# EAGLE design TMC5160_SPI_rev2 (EAGLE 9.2.2)
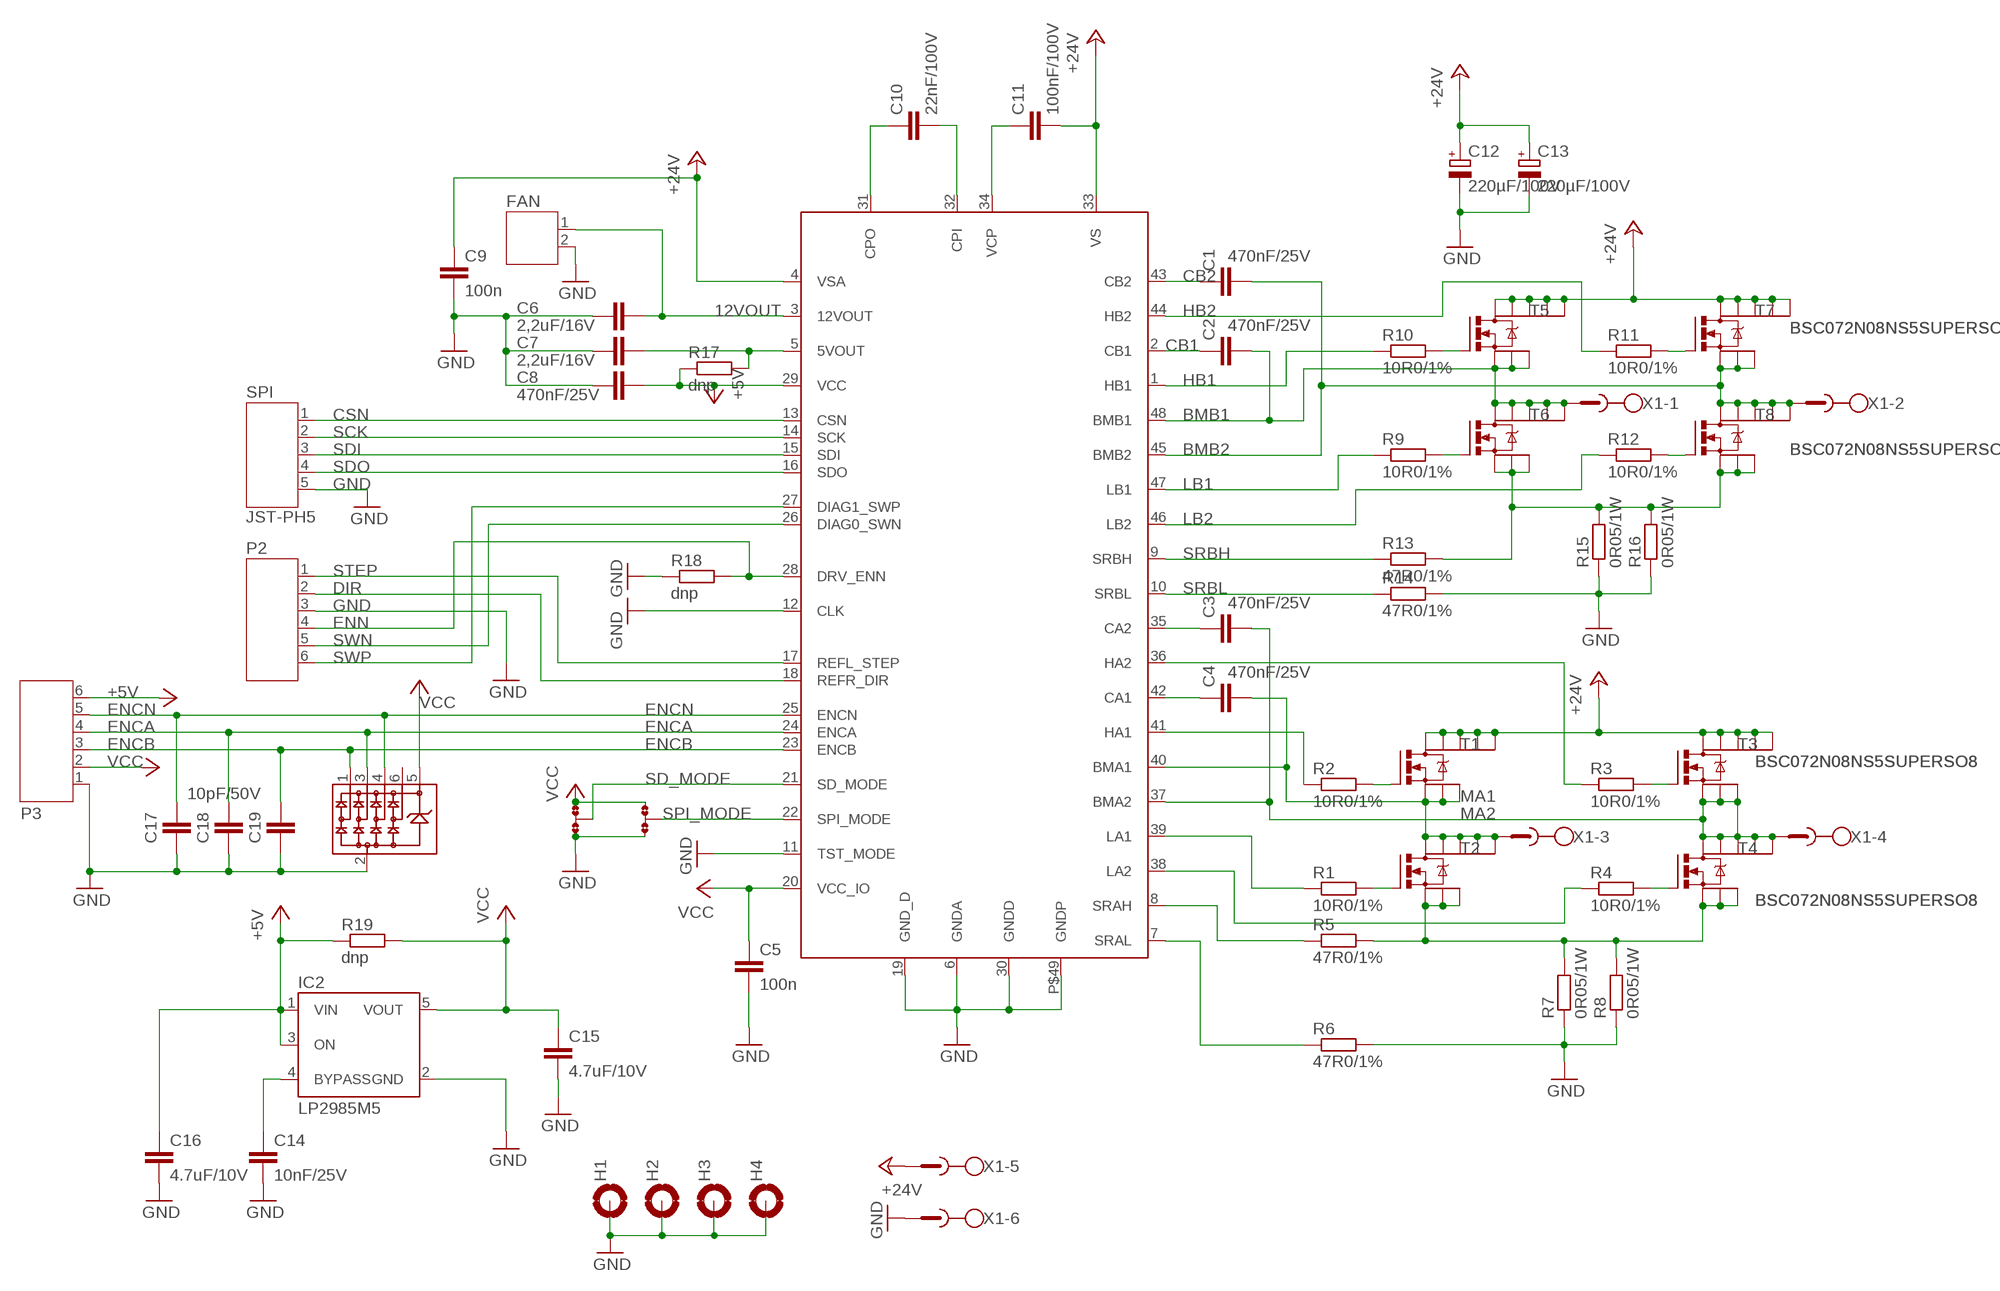
[diagram p0: schematic, sheet 1]

## Parts
C1  470nF/25V  C-EUC0805  [C0805]
C2  470nF/25V  C-EUC0805  [C0805]
C3  470nF/25V  C-EUC0805  [C0805]
C4  470nF/25V  C-EUC0805  [C0805]
C5  100n  C-EUC0603  [C0603]
C6  2,2uF/16V  C-EUC0805  [C0805]
C7  2,2uF/16V  C-EUC0805  [C0805]
C8  470nF/25V  C-EUC0805  [C0805]
C9  100n  C-EUC0603  [C0603]
C10  22nF/100V  C-EUC0805  [C0805]
C11  100nF/100V  C-EUC0805  [C0805]
C12  220µF/100V  CPOL-EU153CLV-1014  [153CLV-1014]
C13  220µF/100V  CPOL-EU153CLV-1014  [153CLV-1014]
C14  10nF/25V  C-EUC0603  [C0603]
C15  4.7uF/10V  C-EUC0603  [C0603]
C16  4.7uF/10V  C-EUC0603  [C0603]
C17  10pF/50V  C-EUC0603  [C0603]
C18  10pF/50V  C-EUC0603  [C0603]
C19  10pF/50V  C-EUC0603  [C0603]
D1  SRV05-4SOT23-6-3D  [SOT23-6]
FAN  JST-PH2  [JST-PH2]
H1  MOUNT-PAD-ROUND3.2  [3,2-PAD]
H2  MOUNT-PAD-ROUND3.2  [3,2-PAD]
H3  MOUNT-PAD-ROUND3.2  [3,2-PAD]
H4  MOUNT-PAD-ROUND3.2  [3,2-PAD]
IC2  LP2985M5  [SOT23-5]
JMP1  0R-JUMPA  [A0R-JMP]
JMP2  0R-JUMPA  [A0R-JMP]
P2  JST-PH6  [JST-PH6]
P3  JST-PH6  [JST-PH6]
R1  10R0/1%  R-EU_R0603  [R0603]
R2  10R0/1%  R-EU_R0603  [R0603]
R3  10R0/1%  R-EU_R0603  [R0603]
R4  10R0/1%  R-EU_R0603  [R0603]
R5  47R0/1%  R-EU_R0603  [R0603]
R6  47R0/1%  R-EU_R0603  [R0603]
R7  0R05/1W  R-EU_R3225  [R3225]
R8  0R05/1W  R-EU_R3225  [R3225]
R9  10R0/1%  R-EU_R0603  [R0603]
R10  10R0/1%  R-EU_R0603  [R0603]
R11  10R0/1%  R-EU_R0603  [R0603]
R12  10R0/1%  R-EU_R0603  [R0603]
R13  47R0/1%  R-EU_R0603  [R0603]
R14  47R0/1%  R-EU_R0603  [R0603]
R15  0R05/1W  R-EU_R3225  [R3225]
R16  0R05/1W  R-EU_R3225  [R3225]
R17  dnp  R-EU_R0603  [R0603]
R18  dnp  R-EU_R0603  [R0603]
R19  dnp  R-EU_R0603  [R0603]
SPI  JST-PH5  [JST-PH5]
T1  BSC072N08NS5SUPERSO8  [SOTFL127P615X110-8]
T2  BSC072N08NS5SUPERSO8  [SOTFL127P615X110-8]
T3  BSC072N08NS5SUPERSO8  [SOTFL127P615X110-8]
T4  BSC072N08NS5SUPERSO8  [SOTFL127P615X110-8]
T5  BSC072N08NS5SUPERSO8  [SOTFL127P615X110-8]
T6  BSC072N08NS5SUPERSO8  [SOTFL127P615X110-8]
T7  BSC072N08NS5SUPERSO8  [SOTFL127P615X110-8]
T8  BSC072N08NS5SUPERSO8  [SOTFL127P615X110-8]
TMC5160  TMC5160-TA  [QFP50P900X900X120-48]
X1  AKL166-06  [AKL166-06]

## Nets
12VOUT: C6.2 FAN.1 TMC5160.3(12VOUT)
+5V: C8.2 C16.1 IC2.1(VIN) IC2.3(ON) P3.6 R17.1 R19.1 TMC5160.29(VCC)
+24V: C9.1 C11.2 C12.+ C13.+ T1.D T1.D5(D1) T1.D6(D2) T1.D7(D3) T1.D8(D4) T3.D T3.D5(D1) T3.D6(D2) T3.D7(D3) T3.D8(D4) T5.D T5.D5(D1) T5.D6(D2) T5.D7(D3) T5.D8(D4) T7.D T7.D5(D1) T7.D6(D2) T7.D7(D3) T7.D8(D4) TMC5160.4(VSA) TMC5160.33(VS) X1.5
BMB1: C2.2 T5.S1 T5.S2 T5.S3(S) T6.D T6.D5(D1) T6.D6(D2) T6.D7(D3) T6.D8(D4) TMC5160.48(BMB1) X1.1
BMB2: C1.2 T7.S1 T7.S2 T7.S3(S) T8.D T8.D5(D1) T8.D6(D2) T8.D7(D3) T8.D8(D4) TMC5160.45(BMB2) X1.2
CB1: C2.1 TMC5160.2(CB1)
CB2: C1.1 TMC5160.43(CB2)
CSN: SPI.1 TMC5160.13(CSN)
DIR: P2.2 TMC5160.18(REFR_DIR)
ENCA: C18.1 D1.3 P3.4 TMC5160.24(ENCA)
ENCB: C19.1 D1.1 P3.3 TMC5160.23(ENCB)
ENCN: C17.1 D1.4 P3.5 TMC5160.25(ENCN)
ENN: P2.4 R18.2 TMC5160.28(DRV_ENN)
GND: C5.2 C6.1 C7.2 C8.1 C9.2 C12.- C13.- C14.2 C15.2 C16.2 C17.2 C18.2 C19.2 D1.2 FAN.2 H1.B3,2(MOUNT) H2.B3,2(MOUNT) H3.B3,2(MOUNT) H4.B3,2(MOUNT) IC2.2(GND) JMP1.3 JMP2.3 P2.3 P3.1 R6.2 R7.1 R8.1 R14.2 R15.1 R16.1 R18.1 SPI.5 TMC5160.6(GNDA) TMC5160.11(TST_MODE) TMC5160.12(CLK) TMC5160.19(GND_D) TMC5160.30(GNDD) TMC5160.P$49(GNDP) X1.6
HB1: R10.1 TMC5160.1(HB1)
HB2: R11.1 TMC5160.44(HB2)
LB1: R9.1 TMC5160.47(LB1)
LB2: R12.1 TMC5160.46(LB2)
MA1: C4.2 T1.S1 T1.S2 T1.S3(S) T2.D T2.D5(D1) T2.D6(D2) T2.D7(D3) T2.D8(D4) TMC5160.40(BMA1) X1.3
MA2: C3.2 T3.S1 T3.S2 T3.S3(S) T4.D T4.D5(D1) T4.D6(D2) T4.D7(D3) T4.D8(D4) TMC5160.37(BMA2) X1.4
N$1: R1.2 T2.G
N$2: R2.2 T1.G
N$3: R3.2 T3.G
N$4: R4.2 T4.G
N$7: R5.2 R7.2 R8.2 T2.S1 T2.S2 T2.S3(S) T4.S1 T4.S2 T4.S3(S)
N$11: R9.2 T6.G
N$12: R10.2 T5.G
N$13: R11.2 T7.G
N$14: R12.2 T8.G
N$15: R13.2 R15.2 R16.2 T6.S1 T6.S2 T6.S3(S) T8.S1 T8.S2 T8.S3(S)
N$26: C4.1 TMC5160.42(CA1)
N$27: C3.1 TMC5160.35(CA2)
N$28: R3.1 TMC5160.36(HA2)
N$29: R4.1 TMC5160.38(LA2)
N$30: R1.1 TMC5160.39(LA1)
N$31: R2.1 TMC5160.41(HA1)
N$32: C14.1 IC2.4(BYPASS)
N$34: R5.1 TMC5160.8(SRAH)
N$35: R6.1 TMC5160.7(SRAL)
N$41: C7.1 R17.2 TMC5160.5(5VOUT)
N$47: C10.1 TMC5160.31(CPO)
N$48: C10.2 TMC5160.32(CPI)
N$49: C11.1 TMC5160.34(VCP)
SCK: SPI.2 TMC5160.14(SCK)
SD_MODE: JMP1.2 TMC5160.21(SD_MODE)
SDI: SPI.3 TMC5160.15(SDI)
SDO: SPI.4 TMC5160.16(SDO)
SPI_MODE: JMP2.2 TMC5160.22(SPI_MODE)
SRBH: R13.1 TMC5160.9(SRBH)
SRBL: R14.1 TMC5160.10(SRBL)
STEP: P2.1 TMC5160.17(REFL_STEP)
SWN: P2.5 TMC5160.26(DIAG0_SWN)
SWP: P2.6 TMC5160.27(DIAG1_SWP)
VCC: C5.1 C15.1 D1.5 IC2.5(VOUT) JMP1.1 JMP2.1 P3.2 R19.2 TMC5160.20(VCC_IO)
Unconnected: D1.6

## Library data of the parts
C1-C11 C14-C19 = rcl:C-EU: CAPACITOR, European symbol; SPICEPREFIX: C
C12 C13 = rcl:CPOL-EU: POLARIZED CAPACITOR, European symbol; SPICEPREFIX: C
D1 = myDBv7:SRV05-4: SRV05-4.TCT TVS DIODE 5V 17.5V SOT23-6 RailClamp®, SR Semtech Corporation Unidirektionale Kanäle 4
FAN = jst-ph:JST-PH2
H1-H4 = holes:MOUNT-PAD-ROUND: MOUNTING PAD, round
IC2 = v-reg-3:LP2985: National Semiconductor <http://www.national.com> Micropower Linear Regulator 150mA regulated output, Vin 16V max., ultra-low dropout of 300mV @ 150mA, 1µA standby current, low noise
JMP1 JMP2 = jump-0r-smd:0R-JUMP: SMD 0R 0805 Jumper
P2 P3 = jst-ph:JST-PH6
R1-R19 = rcl:R-EU_: RESISTOR, European symbol; SPICEPREFIX: R
SPI = jst-ph:JST-PH5
T1-T8 = myDBv7:BSC072N08NS5
TMC5160 = myDBv7:TMC5160-TA
X1 = con-riacon:AKL166-06: RM 3,5mm AKL 166-06 :: Steckbare Anschlussklemme 2-polig, RM3,5mm + STL 224-02 :: Stiftleiste für Anschlussklemme 2-polig, RM3,5mm

## Board
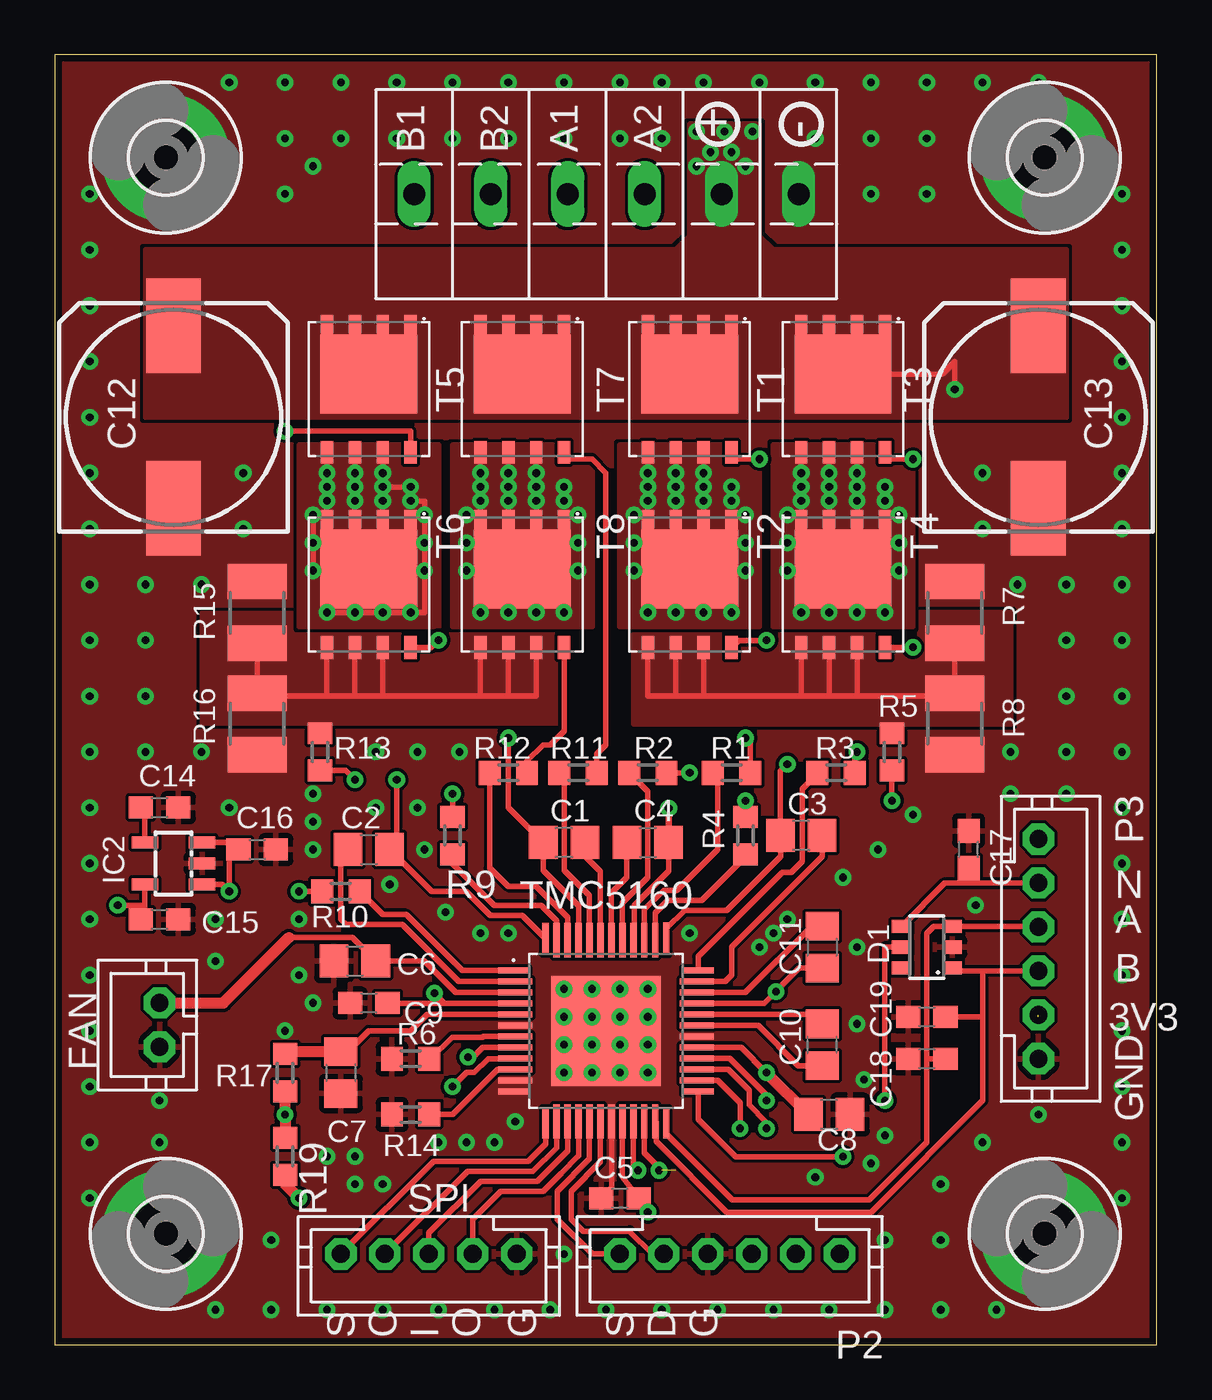
[diagram p1: board, top side]
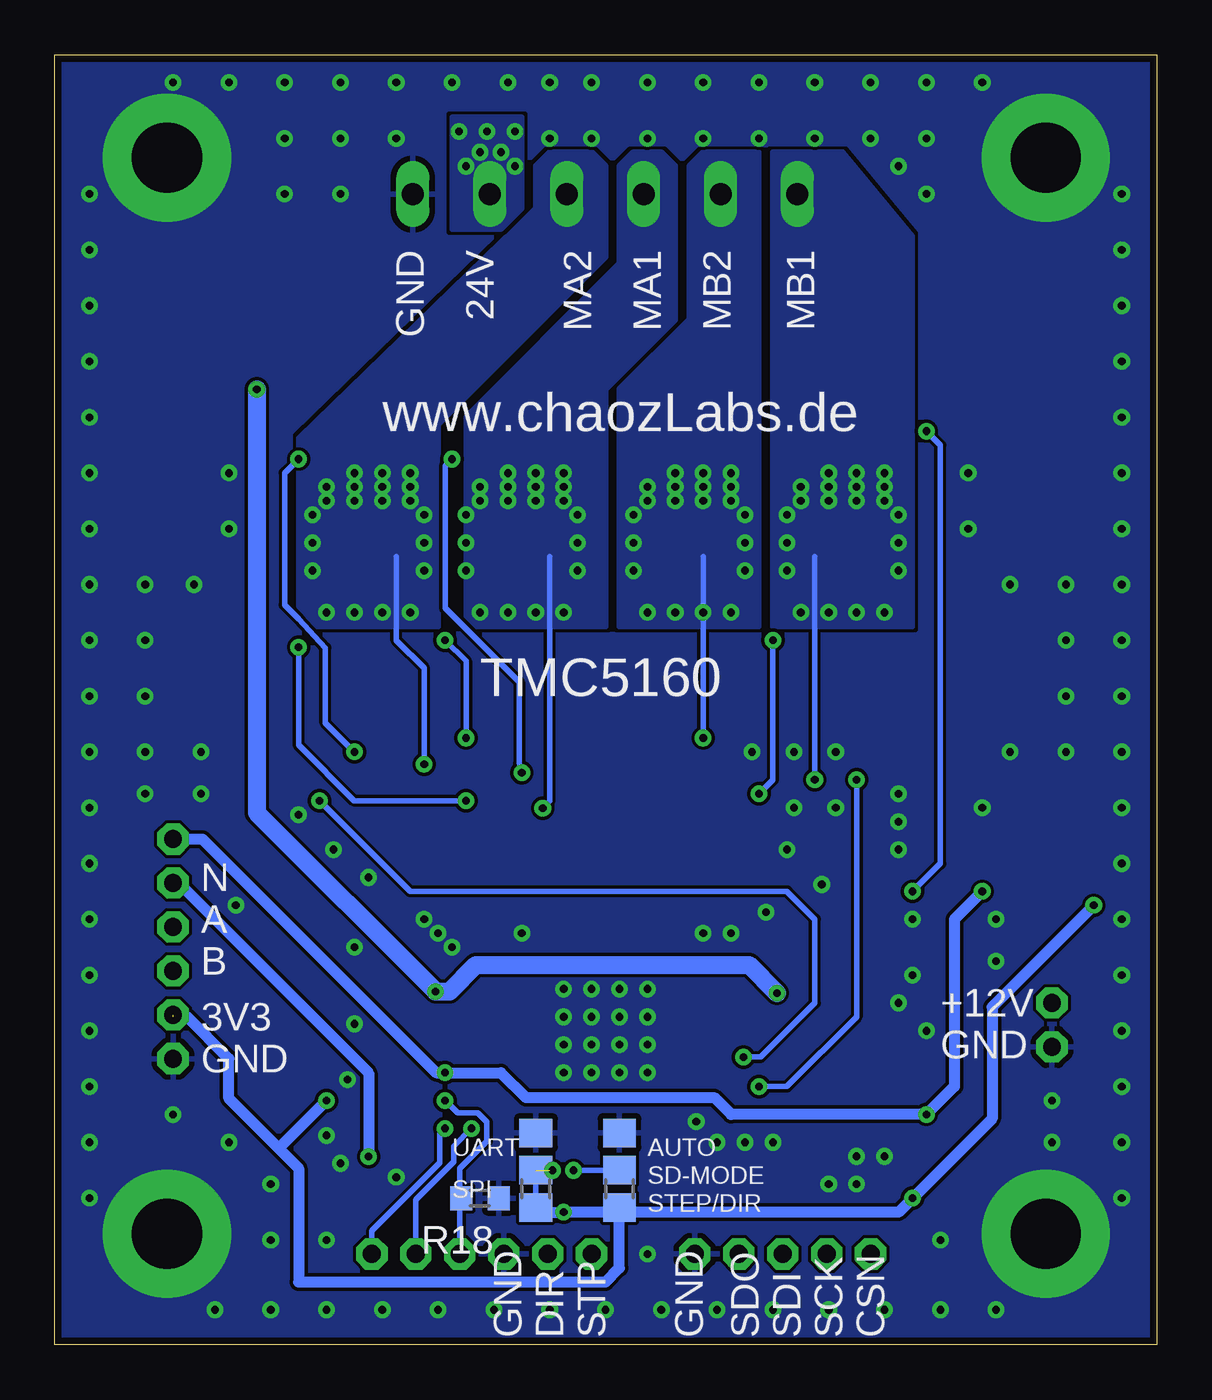
[diagram p2: board, bottom side, seen from below]

Size 50.14 x 58.73 mm. Coordinates in mm from the lower left corner, seen from the top.
Outline: 0,0 50.14,0 50.14,58.73 0,58.73 0,0
Copper layers (1*16): Top 0.035mm / dielectric 1.5mm / Bottom 0.035mm
Design rules "default *": minimum track width 10mil, minimum drill 24mil, track to track 0.15mm, track to pad 0.15mm, pad to pad 0.2mm, via to via 0.2mm, smd to smd 0mil, copper to edge 0.314959375mm, drill to drill 8mil, minimum pad ring 10mil, minimum via ring 8mil, stop-mask expansion 4mil, vias tented up to drill 0.4mm, thermal gap 10mil

### Footprints (pad centres in the part's own frame; a part is rotated, then mirrored left to right if it is on the bottom)
C0805 = smd 1.3 x 1.5: 1 -0.95,0; 2 0.95,0
C0603 = smd 1.1 x 1: 1 -0.85,0; 2 0.85,0
153CLV-1014 = smd 4.3 x 2.5: + 4.15,0; - -4.15,0
SOT23-6 = smd 0.6 x 0.9: 1 -0.95,-1.15; 2 0,-1.15; 3 0.95,-1.15; 4 0.95,1.15; 5 0,1.15; 6 -0.95,1.15
JST-PH2 = drill 0.813 pad 1.422 octagon: 1 0,0; 2 -2,0
3,2-PAD = drill 3.2 pad 5.842: B3,2 0,0
SOT23-5 = smd 0.55 x 1.2: 1 -0.95,-1.3; 2 0,-1.3; 3 0.95,-1.3; 4 0.95,1.3; 5 -0.95,1.3
A0R-JMP = smd 1.5 x 1.3: 1 0,1.7; 2 0,0; 3 0,-1.7
JST-PH6 = drill 0.813 pad 1.422 octagon: 1 0,0; 2 -2,0; 3 -4,0; 4 -6,0; 5 -8,0; 6 -10,0
R0603 = smd 1 x 1.1: 1 -0.85,0; 2 0.85,0
R3225 = smd 1.6 x 2.7: 1 -1.4,0; 2 1.4,0
JST-PH5 = drill 0.813 pad 1.422 octagon: 1 0,0; 2 -2,0; 3 -4,0; 4 -6,0; 5 -8,0
SOTFL127P615X110-8 = smd 3.6 x 4.4: D -0.7,0 | smd 1.029 x 0.566: D5 -2.868,1.905; D6 -2.868,0.635; D7 -2.868,-0.635; D8 -2.868,-1.905; G 2.868,1.905; S1 2.868,-1.905; S2 2.868,-0.635; S3 2.868,0.635
QFP50P900X900X120-48 = smd 1.422 x 0.28: 1 -4.203,2.75; 12 -4.191,-2.75; 25 4.191,-2.75; 36 4.191,2.75 | smd 1.558 x 0.28: 2 -4.127,2.25; 3 -4.127,1.75; 4 -4.127,1.25; 5 -4.127,0.75; 6 -4.127,0.25; 7 -4.127,-0.25; 8 -4.127,-0.75; 9 -4.127,-1.25; 10 -4.127,-1.75; 11 -4.127,-2.25; 26 4.127,-2.25; 27 4.127,-1.75; 28 4.127,-1.25; 29 4.127,-0.75; 30 4.127,-0.25; 31 4.127,0.25; 32 4.127,0.75; 33 4.127,1.25; 34 4.127,1.75; 35 4.127,2.25 | smd 0.28 x 1.422: 13 -2.75,-4.191; 24 2.75,-4.191; 48 -2.75,4.191 | smd 0.28 x 1.558: 14 -2.25,-4.127; 15 -1.75,-4.127; 16 -1.25,-4.127; 17 -0.75,-4.127; 18 -0.25,-4.127; 19 0.25,-4.127; 20 0.75,-4.127; 21 1.25,-4.127; 22 1.75,-4.127; 23 2.25,-4.127; 38 2.25,4.127; 39 1.75,4.127; 40 1.25,4.127; 41 0.75,4.127; 42 0.25,4.127; 43 -0.25,4.127; 44 -0.75,4.127; 45 -1.25,4.127; 46 -1.75,4.127; 47 -2.25,4.127 | smd 0.28 x 1.473: 37 2.75,4.191 | smd 5 x 5: P$49 0,0
AKL166-06 = drill 1 long: 1 -1.75,0; 2 1.75,0; 3 5.25,0; 4 8.75,0; 5 12.25,0; 6 15.75,0

### Placement (x,y rotation side)
C1  23.18,22.86 180 top
C2  14.29,22.54 0 top
C3  33.97,23.18 180 top
C4  26.99,22.86 0 top
C5  25.72,6.67 180 top
C6  13.65,17.46 0 top
C7  13.02,12.38 270 top
C8  35.24,10.48 180 top
C9  14.29,15.56 180 top
C10  34.92,13.65 90 top
C11  34.92,18.1 270 top
C12  5.4,42.23 90 top
C13  44.77,42.23 90 top
C14  4.76,24.45 0 top
C15  4.76,19.37 0 top
C16  9.21,22.54 0 top
C17  41.59,22.54 90 top
C18  39.69,13.02 180 top
C19  39.69,14.92 180 top
D1  39.69,18.1 90 top
FAN  4.76,15.56 90 top
H1  5.05,5.05 0 top
H2  45.05,5.05 90 top
H3  5.05,54.05 90 top
H4  45.05,54.05 90 top
IC2  5.4,21.91 90 top
JMP1  24.45,7.94 180 bottom
JMP2  28.26,7.94 180 bottom
P2  25.72,4.13 180 top
P3  44.77,13.02 270 top
R1  30.8,26.04 0 top
R2  26.99,26.04 0 top
R3  35.56,26.04 0 top
R4  31.43,23.18 90 top
R5  38.1,26.99 90 top
R6  16.19,13.02 180 top
R7  40.96,33.34 270 top
R8  40.96,28.26 90 top
R9  18.1,23.18 90 top
R10  13.02,20.64 180 top
R11  23.81,26.04 0 top
R12  20.64,26.04 0 top
R13  12.06,26.99 90 top
R14  16.19,10.48 180 top
R15  9.21,33.34 270 top
R16  9.21,28.26 90 top
R17  10.48,12.38 90 top
R18  30.8,6.67 180 bottom
R19  10.48,8.57 270 top
SPI  13.02,4.13 180 top
T1  28.89,43.5 270 top
T2  28.89,34.61 270 top
T3  35.88,43.5 270 top
T4  35.88,34.61 270 top
T5  14.29,43.5 270 top
T6  14.29,34.61 270 top
T7  21.27,43.5 270 top
T8  21.27,34.61 270 top
TMC5160  25.08,14.29 0 top
X1  18.1,52.39 0 top

### Tracks (layer width: path | path; a pad name or v marks a point on that pad's centre or on a via)
12VOUT
  Top 0.254: 10.65,18.54 13.53,18.54 C6.2 16.82,17.46 18.25,16.04 TMC5160.3
  Top 0.508: FAN.1 7.67,15.56 10.65,18.54
+5V  (via drill 0.35)
  Top 0.254: TMC5160.29 31.23,13.54 v32.38,12.38 | IC2.1 7.62,20.96 v7.94,20.64 7.94,22.86 | IC2.3 7.94,22.86 | 7.94,22.86 8.04,22.86 C16.1
  Top 0.508: R17.1 v10.48,10.48 R19.1 | C8.2 v32.39,12.38 v32.38,12.38
  Bottom 0.508: v7.94,20.64 9.21,19.37 9.21,11.75 v10.48,10.48 19.37,10.48 20.14,11.25 28.71,11.25 29.84,12.38 v32.38,12.38 32.8,12.38 43.43,23.02 P3.6
+24V  (via drill 0.35)
  Top 0.254: TMC5160.4 17.75,15.54 | 17.75,15.54 15.7,15.54 15.08,15.56 C9.1 | T3.D 40.39,44.2 40.96,44.77 v40.96,43.5 | 17.75,15.54 v17.28,16.01 | 21.91,44.77 T7.D | TMC5160.33 32.28,15.54 v32.82,16.08 33.89,17.15 C11.2
  Bottom 0.813: v40.96,43.5 40.96,24.22 v32.82,16.08 32.18,16.08 30.98,17.28 18.55,17.28 v17.28,16.01
  other vias: 29.21,55.24 30.48,55.24 31.75,55.24 30.8,54.29 29.84,54.29 29.21,53.66 31.43,53.66
  pour Top (no thermals): 28.26,49.85 4.13,49.85 4.13,42.23 46.04,42.23 46.04,49.85 32.7,49.85 32.07,50.48 32.07,55.56 28.89,55.56 28.89,50.48
  pour Bottom (no thermals): 28.89,55.88 32.07,55.88 32.07,50.8 29.84,50.8 28.89,51.75
BMB1  (via drill 0.35)
  Top 0.254: T5.S1 v12.38,39.69 v12.38,39.05 v12.38,38.42 T6.D8 | T5.S3 v14.92,39.69 v14.92,39.05 | v14.92,39.05 v14.92,38.42 T6.D6 14.92,35.94 14.57,35.59 | T5.S2 v13.65,39.69 v13.65,39.05 v13.65,38.42 T6.D7 | T6.D5 16.19,35.24 15.89,34.94 15.56,34.94 15.19,35.31 T6.D 14.57,35.59 | 12.38,35.24 13.02,35.88 13.65,35.24 v13.65,33.34 | v14.92,33.34 14.57,33.69 14.57,34.96 | v16.19,33.34 14.57,34.96 | 14.57,34.96 14.57,35.59 | v11.75,37.78 v11.75,36.51 v11.75,35.24 12.38,35.24 | 12.38,35.24 v12.38,33.34 v13.65,33.34 | v13.65,33.34 v14.92,33.34 | v14.92,33.34 v16.19,33.34 | v16.19,33.34 16.83,33.34 v16.83,35.24 v16.83,36.51 v16.83,37.78 16.83,38.42 v16.19,38.42 v16.19,39.05 v14.92,39.05 | v15.56,25.72 15.56,22.86 C2.2 17.14,20.64 18.72,20.64 19.81,19.55 21.27,19.55 TMC5160.48
  Bottom 0.254: v15.56,25.72 15.56,35.88
  pour Bottom (no thermals): 17.46,54.29 17.46,32.7 11.11,32.7 11.11,50.48 14.29,54.29
  pour Top (no thermals): 11.11,40.96 11.11,32.7 17.46,32.7 17.46,40.96
BMB2  (via drill 0.35)
  Top 0.254: TMC5160.45 23.83,19.98 22.23,21.59 C1.2 21.91,23.18 20.64,24.45 v20.64,27.62 | T7.S1 v19.37,39.69 v19.37,39.05 v19.37,38.42 T8.D8 | T8.D6 v21.91,38.42 v21.91,39.05 v21.91,39.69 T7.S3 | T7.S2 v20.64,39.69 v20.64,39.05 v20.64,38.42 T8.D7 21.27,35.94 T8.D 22.61,35.31 23.18,35.88 T8.D5
  Bottom 0.254: v20.64,27.62 20.64,35.88
  other vias: 18.73,37.78 18.73,36.51 18.73,35.24 19.37,33.34 20.64,33.34 21.91,33.34 23.18,33.34 23.81,35.24 23.81,36.51 23.81,37.78 23.18,38.42 23.18,39.05
  pour Bottom (no thermals): 18.1,54.29 18.1,32.7 24.45,32.7 24.45,43.5 21.27,46.67 21.27,53.66 20.64,54.29
  pour Top (no thermals): 18.1,40.96 18.1,32.7 24.45,32.7 24.45,40.96
CB1
  Top 0.254: TMC5160.2 18.39,16.54 15.8,19.12 13.26,19.12 13.02,19.37 13.02,21.91 13.34,22.23 C2.1
CB2
  Top 0.254: TMC5160.43 24.83,21.55 24.13,22.25 C1.1
CSN
  Top 0.254: TMC5160.13 22.33,9.14 21.54,8.35 17.24,8.35 SPI.1
DIR
  Top 0.254: P2.2 27.19,4.13 26.15,5.17 24.04,5.17 23.5,5.72 23.5,6.99 24.83,8.32 TMC5160.18
ENCA
  Top 0.254: 44.74,19.05 D1.3 40,19.05 39.69,18.73 39.69,13.02 | TMC5160.24 27.83,9.59 30.82,6.6 37.08,6.6 39.69,9.21 39.69,13.02 | C18.1 39.69,13.02
  Top 0.508: P3.4 44.74,19.05
ENCB
  Top 0.254: 42.23,17.02 40.97,17.02 D1.1 | TMC5160.23 27.37,10.13 27.37,9.25 30.58,6.03 37.15,6.03 42.23,11.11 42.23,14.92 | 42.23,14.92 42.23,17.02 | C19.1 42.23,14.92 | P3.3 42.23,17.02
ENCN  (via drill 0.35)
  Top 0.254: v35.87,8.56 30.98,8.56 29.27,10.27 TMC5160.25 | D1.4 40.51,21.02 41.59,21.02 | 41.59,21.02 P3.5 | C17.1 41.59,21.02
  Bottom 0.508: v35.87,8.56 35.87,12.37 44.51,21.02 P3.5
ENN  (via drill 0.35)
  Top 0.254: TMC5160.28 30.71,13.04 32.38,11.37 v32.38,11.11
  Bottom 0.254: 31.72,6.67 31.72,8.03 30.48,9.27 30.48,10.13 30.89,10.55 31.82,10.55 v32.38,11.11 | 31.72,6.67 P2.4 | R18.2 31.72,6.67
GND  (via drill 0.35)
  Top 0.254: TMC5160.19 25.35,10.14 25.35,7.15 C5.2
  other vias: 11.75,15.56 11.11,19.37 11.11,16.83 10.48,14.29 20.95,10.16 20,9.21 18.73,9.21 17.46,9.21 19.37,18.73 20.64,18.73 28.89,18.73 36.83,12.06 9.84,1.59 7.3,1.59 23.18,4.13 44.77,10.48 42.23,9.21 4.76,11.11 4.76,9.21 15.56,57.47 18.1,57.47 20.64,57.47 23.18,57.47 25.72,57.47 27.62,57.47 29.53,57.47 32.07,57.47 34.61,57.47 37.15,57.47 39.69,57.47 42.23,57.47 44.77,57.47 13.02,57.47 10.48,57.47 1.59,49.85 1.59,47.31 1.59,44.77 1.59,42.23 1.59,39.69 1.59,37.15 1.59,34.61 1.59,32.07 1.59,29.53 1.59,26.99 1.59,24.45 1.59,21.91 1.59,19.37 1.59,16.83 1.59,14.29 1.59,11.75 1.59,9.21 1.59,6.67 1.59,52.39 12.38,1.59 14.92,1.59 17.46,1.59 20,1.59 22.54,1.59 25.08,1.59 27.62,1.59 30.16,1.59 32.7,1.59 35.24,1.59 37.78,1.59 40.32,1.59 42.86,1.59 7.94,57.47 8.57,37.15 8.57,39.69 4.13,34.61 6.67,34.61 4.13,32.07 4.13,29.53 4.13,26.99 6.67,26.99 40.32,7.3 37.78,4.76 40.32,4.76 9.84,4.76 13.65,8.57 13.65,7.3 14.92,7.3 12.38,8.57 11.75,22.54 11.75,23.81 11.75,25.08 14.6,24.45 16.51,24.45 16.83,22.54 16.51,26.99 18.41,26.99 14.6,26.99 7.94,24.45 7.3,19.37 7.3,17.46 35.88,21.27 37.46,22.54 39.05,24.13 34.61,7.62 37.78,9.52 42.23,39.69 42.23,37.15 48.58,42.23 48.58,39.69 48.58,37.15 48.58,34.61 48.58,32.07 48.58,29.53 48.58,26.99 48.58,24.45 48.58,21.91 48.58,19.37 48.58,16.83 48.58,14.29 48.58,11.75 48.58,9.21 48.58,6.67 48.58,44.77 48.58,47.31 48.58,49.85 48.58,52.39 46.04,26.99 46.04,29.53 46.04,32.07 46.04,34.61 43.81,34.61 46.04,25.08 43.5,25.08 36.51,14.6 41.91,20 37.15,54.93 37.15,52.39 39.69,54.93 39.69,52.39 13.02,54.93 10.48,54.93 10.48,52.39 15.24,20.95 17.78,19.68 34.61,54.93 15.56,54.93 11.75,53.66 18.1,54.93 20.64,54.93 23.18,54.93 25.72,54.93 27.62,54.93 43.5,26.99 23.18,12.38 25.72,12.38 25.72,14.92 24.45,13.65 26.99,12.38 23.18,13.65 25.72,13.65 23.18,14.92 26.99,13.65 26.99,14.92 26.99,16.19 25.72,16.19 24.45,16.19 23.18,16.19 24.45,14.92 24.45,12.38 33.34,19.37 32.7,18.73 32.07,18.1 36.51,18.1 37.15,8.25
  pour Top (rank 6): 0.32,58.74 0.32,0.32 49.85,0.32 49.85,58.74
  pour Bottom (rank 6): 0.32,58.74 0.32,0.32 49.85,0.32 49.85,58.74
  pour Top (rank 5, no thermals): 40.96,49.85 40.96,58.74 9.21,58.74 9.21,49.85 0.32,49.85 0.32,25.72 49.85,25.72 49.85,49.85
HB1
  Top 0.254: R10.1 14.93,19.58 15.99,19.58 18.53,17.04 TMC5160.1
HB2
  Top 0.254: TMC5160.44 24.33,20.45 23.18,21.6 23.18,25.94 R11.1
LB1
  Top 0.254: TMC5160.47 22.83,19.3 22.13,20 20,20 18.09,21.92 18.09,22.12 18.1,22.11 R9.1
LB2
  Top 0.254: TMC5160.46 23.33,19.45 21.92,20.86 20.64,20.86 19.79,21.71 R12.1
MA1  (via drill 0.35)
  Top 0.254: TMC5160.40 26.36,18.44 26.36,19.99 27.94,21.56 C4.2 | T2.D8 v26.99,38.42 v26.99,39.05 v26.99,39.69 T1.S1 | T1.S3 v29.53,39.69 v29.53,39.05 v29.53,38.42 T2.D6 30.16,35.94 T2.D 30.23,35.31 30.8,35.88 T2.D5 | T1.S2 v28.26,39.69 v28.26,39.05 v28.26,38.42 T2.D7
  Top 0.305: C4.2 27.94,24.1 v27.94,24.42
  Bottom 0.254: v27.94,24.42 27.91,24.42 27.62,24.77 27.62,35.88
  other vias: 30.8,39.05 30.8,38.42 26.35,37.78 26.35,36.51 26.35,35.24 26.99,33.34 28.26,33.34 29.53,33.34 30.8,33.34 31.43,35.24 31.43,36.51 31.43,37.78
  pour Bottom (no thermals): 21.91,53.66 21.91,46.67 25.08,43.5 25.08,32.7 31.43,32.7 31.43,42.23 24.45,49.21 24.45,53.66 23.81,54.29 22.54,54.29
  pour Top (no thermals): 25.72,40.96 25.72,32.7 32.07,32.7 32.07,40.96
MA2  (via drill 0.35)
  Top 0.254: T4.D8 v33.97,38.42 v33.97,39.05 v33.97,39.69 T3.S1 | T4.D7 v35.24,38.42 v35.24,39.05 v35.24,39.69 T3.S2 | T3.S3 v36.51,39.69 v36.51,39.05 v36.51,38.42 T4.D6 36.51,35.94 36.45,35.88 | T4.D5 37.78,36.51 37.15,35.88 36.45,35.88 | 36.45,35.88 T4.D | TMC5160.37 27.83,18.94 28.66,19.77 30.58,19.77 33.04,22.22 C3.2 33.02,26.11 v33.34,26.43
  Bottom 0.254: v33.34,26.43 33.34,30.8 34.61,32.07 34.61,35.88
  other vias: 37.78,38.42 37.78,39.05 33.34,37.78 33.34,36.51 33.34,35.24 38.42,37.78 38.42,36.51 38.42,35.24 37.78,33.34 36.51,33.34 35.24,33.34 33.97,33.34
  pour Bottom (rank 2, no thermals): 25.08,53.66 25.08,49.53 32.7,41.91 32.7,32.7 39.05,32.7 39.05,41.27 28.26,51.75 28.26,53.66 27.62,54.29 25.72,54.29
  pour Top (no thermals): 32.7,40.96 32.7,32.7 39.05,32.7 39.05,40.96
N$1  (via drill 0.35)
  Top 0.254: T2.G 31.13,32.07 v32.38,32.07 | R1.2 31.65,27.41 v31.43,27.62
  Bottom 0.254: v31.43,27.62 31.43,31.12 v32.38,32.07
N$2  (via drill 0.35)
  Top 0.254: v32.07,40.32 31.1,40.32 T1.G | R2.2 v28.89,26.04
  Bottom 0.254: v32.07,40.32 32.38,40.01 32.38,33.53 29.01,30.16 29.01,26.47 v28.89,26.04
N$3  (via drill 0.35)
  Top 0.254: T3.G 38.09,40.32 v39.05,40.32 | R3.2 36.41,26.88 v36.51,26.99
  Bottom 0.254: v39.05,40.32 39.69,39.69 39.69,33.68 39.05,33.04 37.83,31.73 37.83,28.3 v36.51,26.99
N$4  (via drill 0.35)
  Top 0.254: v39.05,31.75 39.04,31.74 T4.G
  Top 0.305: R4.2 v31.43,24.77
  Bottom 0.254: v31.43,24.77 36.51,24.77 39.05,27.31 v39.05,31.75
N$7
  Top 0.254: T2.S1 26.99,29.53 28.26,29.53 | 36.51,29.53 40.83,29.53 R8.2 R7.2 | 36.51,29.53 35.24,29.53 | 35.24,29.53 33.97,29.53 | 33.97,29.53 29.53,29.53 | 29.53,29.53 28.26,29.53 | T2.S2 28.26,29.53 | T2.S3 29.53,29.53 | T4.S1 33.97,29.53 | T4.S2 35.24,29.53 | T4.S3 36.51,29.53
  pour Top (rank 2, no thermals): 26.35,33.34 26.35,28.26 43.5,28.26 43.5,33.34
N$11  (via drill 0.35)
  Top 0.254: 17.89,24.24 R9.2 v18.1,25.08 | T6.G 17.13,31.74 v17.46,32.07
  Bottom 0.254: v17.46,32.07 17.46,25.72 v18.1,25.08
N$12  (via drill 0.35)
  Top 0.254: T5.G 16.19,41.59 v10.48,41.59 | R10.2 v11.11,20.64
  Bottom 0.254: v10.48,41.59 9.84,40.96 9.84,21.91 v11.11,20.64
N$13
  Top 0.254: R11.2 24.66,26.88 25.08,27.31 25.08,39.69 24.45,40.32 23.48,40.32 T7.G
N$14
  Top 0.254: T8.G 23.18,27.94 22.54,27.31 22.22,27.31 21.49,26.57 R12.2
N$15
  Top 0.254: R15.2 R16.2 9.34,29.53 12.38,29.53 | T8.S3 21.91,29.53 20.64,29.53 | 20.64,29.53 19.37,29.53 | 19.37,29.53 14.92,29.53 | 14.92,29.53 13.65,29.53 | 13.65,29.53 12.38,29.53 | T6.S1 12.38,29.53 | T6.S2 13.65,29.53 | T6.S3 14.92,29.53 | T8.S1 19.37,29.53 | T8.S2 20.64,29.53
  pour Top (rank 2, no thermals): 6.67,33.34 6.67,28.26 23.18,28.26 23.18,33.34
N$26
  Top 0.254: TMC5160.42 25.33,20.57 26.04,21.27 C4.1
N$27
  Top 0.254: TMC5160.35 30.51,16.54 30.8,16.83 30.8,18.1 34.61,21.91 34.92,22.23 C3.1
N$28
  Top 0.254: TMC5160.36 29.27,17.67 33.1,21.5 33.51,21.5 34.02,22.01 34.02,25.3 34.71,25.99 R3.1
N$29
  Top 0.254: TMC5160.38 27.33,19.67 27.89,20.22 29.44,20.22 31.43,22.21 R4.1
N$30
  Top 0.254: TMC5160.39 26.83,19.81 27.7,20.68 28.3,20.68 30.16,22.54 30.16,26.14 R1.1
N$31
  Top 0.254: TMC5160.41 25.83,20.11 26.99,21.26 26.99,25.18 R2.1
N$32
  Top 0.254: C14.1 4.1,24 IC2.4
N$34  (via drill 0.35)
  Top 0.254: TMC5160.8 19.48,13.54 19.04,13.09 v18.81,13.09 | R5.1 v38.1,24.77
  Bottom 0.254: v38.1,24.77 33.97,20.64 16.83,20.64 15.56,19.37 15.56,15.56 18.02,13.09 v18.81,13.09
N$35
  Top 0.254: TMC5160.7 19.5,14.04 19.45,13.99 18.07,13.99 17.11,13.02 R6.1 17.04,13.23
N$41
  Top 0.254: 10.58,13.33 R17.2 | TMC5160.5 16.94,15.04 16.19,14.29 14.29,14.29 13.02,13.02 C7.1
  Top 0.508: C7.1 10.58,13.33
N$47
  Top 0.254: C10.1 33.84,12.7 32.01,14.54 TMC5160.31
N$48
  Top 0.254: TMC5160.32 34.62,15.04 C10.2
N$49
  Top 0.254: TMC5160.34 31.43,16.04 34.44,19.05 C11.1
SCK
  Top 0.254: SPI.2 18.78,7.89 21.76,7.89 22.83,8.97 TMC5160.14
SD_MODE  (via drill 0.35)
  Top 0.254: TMC5160.21 26.33,7.96 26.35,7.94 v26.54,7.94
  Bottom 0.254: v26.54,7.94 JMP1.2
SDI
  Top 0.254: SPI.3 17.02,5.08 19.38,7.44 21.96,7.44 23.33,8.82 TMC5160.15
SDO
  Top 0.254: SPI.4 19.02,5.72 20.29,6.99 22.22,6.99 23.04,7.8 23.04,7.81 23.8,8.57 23.83,8.6 TMC5160.16
SPI_MODE  (via drill 0.35)  (1 unrouted)
  Top 0.254: TMC5160.22 26.83,8.73 27.62,7.94 v27.5,7.94
  Bottom 0.254: JMP2.2 28.26,6.03
SRBH  (via drill 0.35)
  Top 0.254: TMC5160.9 20.94,13.02 19.73,13.02 19.1,12.39 18.74,12.39 v18.1,11.75 | v13.65,25.72 13.23,26.14 R13.1
  Bottom 0.254: v13.65,25.72 13.65,14.92 16.83,11.75 v18.1,11.75
SRBL
  Top 0.254: TMC5160.10 20.16,12.54 18.1,10.48 R14.1
STEP
  Top 0.254: TMC5160.17 24.33,8.46 22.86,6.99 22.86,5.72 24.45,4.13 P2.1
SWN  (via drill 0.35)
  Top 0.254: v31.19,9.83 v31.19,9.84 31.19,11.01 30.16,12.04 TMC5160.26
  Bottom 0.254: P2.5 33.72,6.6 32,8.32 32,9.03 v31.19,9.84
SWP  (via drill 0.35)
  Top 0.254: TMC5160.27 30.64,12.54 30.8,12.38 31.59,11.59 31.59,10.91 32.38,10.12 v32.38,9.84
  Bottom 0.254: v32.38,9.84 32.62,9.61 32.62,8.27 35.72,5.17 P2.6
VCC  (via drill 0.35)  (1 unrouted)
  Top 0.254: TMC5160.20 25.83,7.63 C5.1 26.77,6.25 v26.99,6.03 | v2.86,20 3.91,20 4.1,19.82 | C15.1 3.7,19.58 4.1,19.82 | IC2.5 4.1,19.82 | D1.5 37.78,18.1 v37.78,11.11
  Top 0.508: R19.2 10.48,7.3 v11.11,6.67
  Bottom 0.254: JMP2.1 28.69,6.03 | JMP1.1 24.65,6.03 v26.99,6.03
  Bottom 0.508: 28.69,6.03 v26.99,6.03 24.45,6.03 | 39.96,8.94 42.23,11.21 42.23,13.02 44.13,14.92 44.77,14.92 | v2.86,20 7.48,15.38 7.48,10.29 v11.11,6.66 | 24.45,6.03 11.74,6.03 v11.11,6.66 | v37.78,11.11 39.96,8.94 | 39.96,8.94 39.05,8.03 39.05,2.86 25.08,2.86 24.45,3.49 24.45,6.03 | v11.11,6.67 v11.11,6.66

### Text on the board
bPlace: www.chaozLabs.de | TMC5160
tNames: + | - | B1 | B2 | A1 | A2 | N | A | B | 3V3 | GND | S | C | I | O | G | S | D | G
bNames: MB1 | MB2 | MA1 | MA2 | 24V | GND | N | A | B | +12V | 3V3 | GND | GND | AUTO | UART | SD-MODE | SPI | STEP/DIR | CSN | SCK | SDI | SDO | GND | STP | DIR | GND